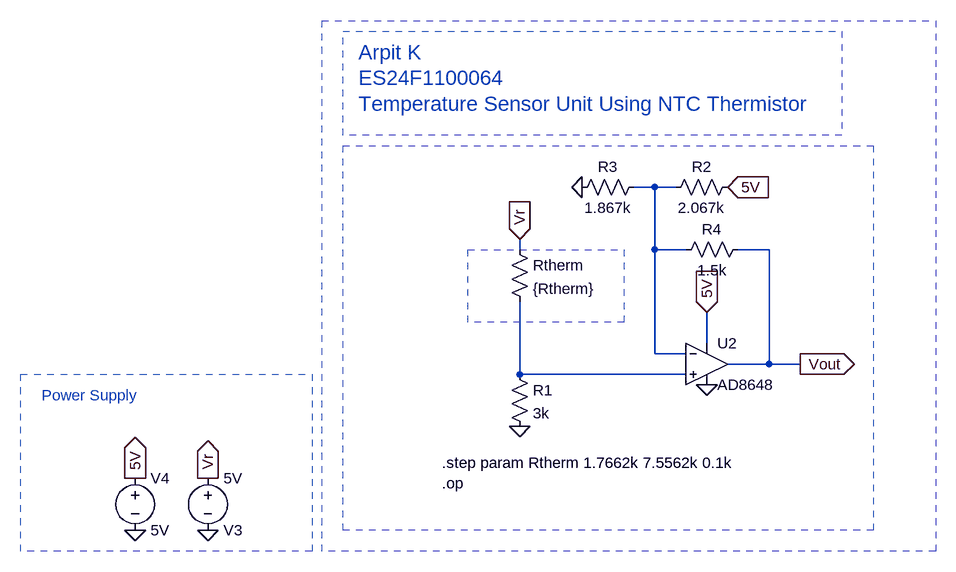
[diagram p0: schematic Sensors_LAB_2.asc]
Sensors_LAB_2.asc, the LTspice schematic file:
Version 4
SHEET 1 948 680
WIRE 256 -32 224 -32
WIRE 288 -32 256 -32
WIRE 48 64 48 48
WIRE 256 64 256 -32
WIRE 304 64 256 64
WIRE 432 64 384 64
WIRE 336 208 336 160
WIRE 256 224 256 64
WIRE 304 224 256 224
WIRE 432 240 432 64
WIRE 432 240 368 240
WIRE 480 240 432 240
WIRE 48 256 48 144
WIRE 304 256 48 256
FLAG 144 -32 0
FLAG -544 496 0
FLAG 48 336 0
FLAG 336 272 0
FLAG -432 496 0
FLAG -544 416 5V
IOPIN -544 416 Out
FLAG 368 -32 5V
IOPIN 368 -32 In
FLAG 336 160 5V
IOPIN 336 160 In
FLAG 480 240 Vout
IOPIN 480 240 Out
FLAG -432 416 Vr
IOPIN -432 416 Out
FLAG 48 48 Vr
IOPIN 48 48 In
SYMBOL res 400 48 R90
WINDOW 0 0 56 VBottom 2
WINDOW 3 32 56 VTop 2
SYMATTR InstName R4
SYMATTR Value 1.5k
SYMBOL res 384 -48 R90
WINDOW 0 0 56 VBottom 2
WINDOW 3 32 56 VTop 2
SYMATTR InstName R2
SYMATTR Value 2.067k
SYMBOL res 240 -48 R90
WINDOW 0 0 56 VBottom 2
WINDOW 3 32 56 VTop 2
SYMATTR InstName R3
SYMATTR Value 1.867k
SYMBOL res 32 240 R0
SYMATTR InstName R1
SYMATTR Value 3k
SYMBOL res 32 48 R0
SYMATTR InstName Rtherm
SYMATTR Value {Rtherm}
SYMBOL voltage -432 400 R0
WINDOW 0 24 96 Left 2
WINDOW 3 24 16 Left 2
WINDOW 123 0 0 Left 0
WINDOW 39 0 0 Left 0
SYMATTR InstName V3
SYMATTR Value 5V
SYMBOL voltage -544 400 R0
WINDOW 123 0 0 Left 0
WINDOW 39 0 0 Left 0
SYMATTR InstName V4
SYMATTR Value 5V
SYMBOL OpAmps\\AD8648 336 176 R0
SYMATTR InstName U2
TEXT -72 392 Left 2 !.step param Rtherm 1.7662k 7.5562k 0.1k\n.op
TEXT -200 -160 Left 3 ;Temperature Sensor Unit Using NTC Thermistor
TEXT -200 -240 Left 3 ;Arpit K
TEXT -200 -200 Left 3 ;ES24F1100064
TEXT -688 288 Left 2 ;Power Supply
RECTANGLE Normal 688 528 -256 -288 3
RECTANGLE Normal 544 -112 -224 -272 2
RECTANGLE Normal 592 496 -224 -96 2
RECTANGLE Normal 208 176 -32 64 2
RECTANGLE Normal -272 528 -720 256 2

The netlist it stands for:
* Sensors_LAB_2.asc
R4 Vout N001 1.5k
R2 5V N001 2.067k
R3 N001 0 1.867k
R1 N002 0 3k
Rtherm Vr N002 {Rtherm}
V3 Vr 0 5V
V4 5V 0 5V
XU2 N002 N001 5V 0 Vout AD8648  ; pins In+ In- V+ V- OUT
.step param Rtherm 1.7662k 7.5562k 0.1k
.op
* Temperature Sensor Unit Using NTC Thermistor
* Arpit K
* ES24F1100064
* Power Supply
.lib ADI.lib
.backanno
.end